# EasyEDA Pro project LY-TB6600-V1.0.eprj

# Board LY_TB6600_V1.0
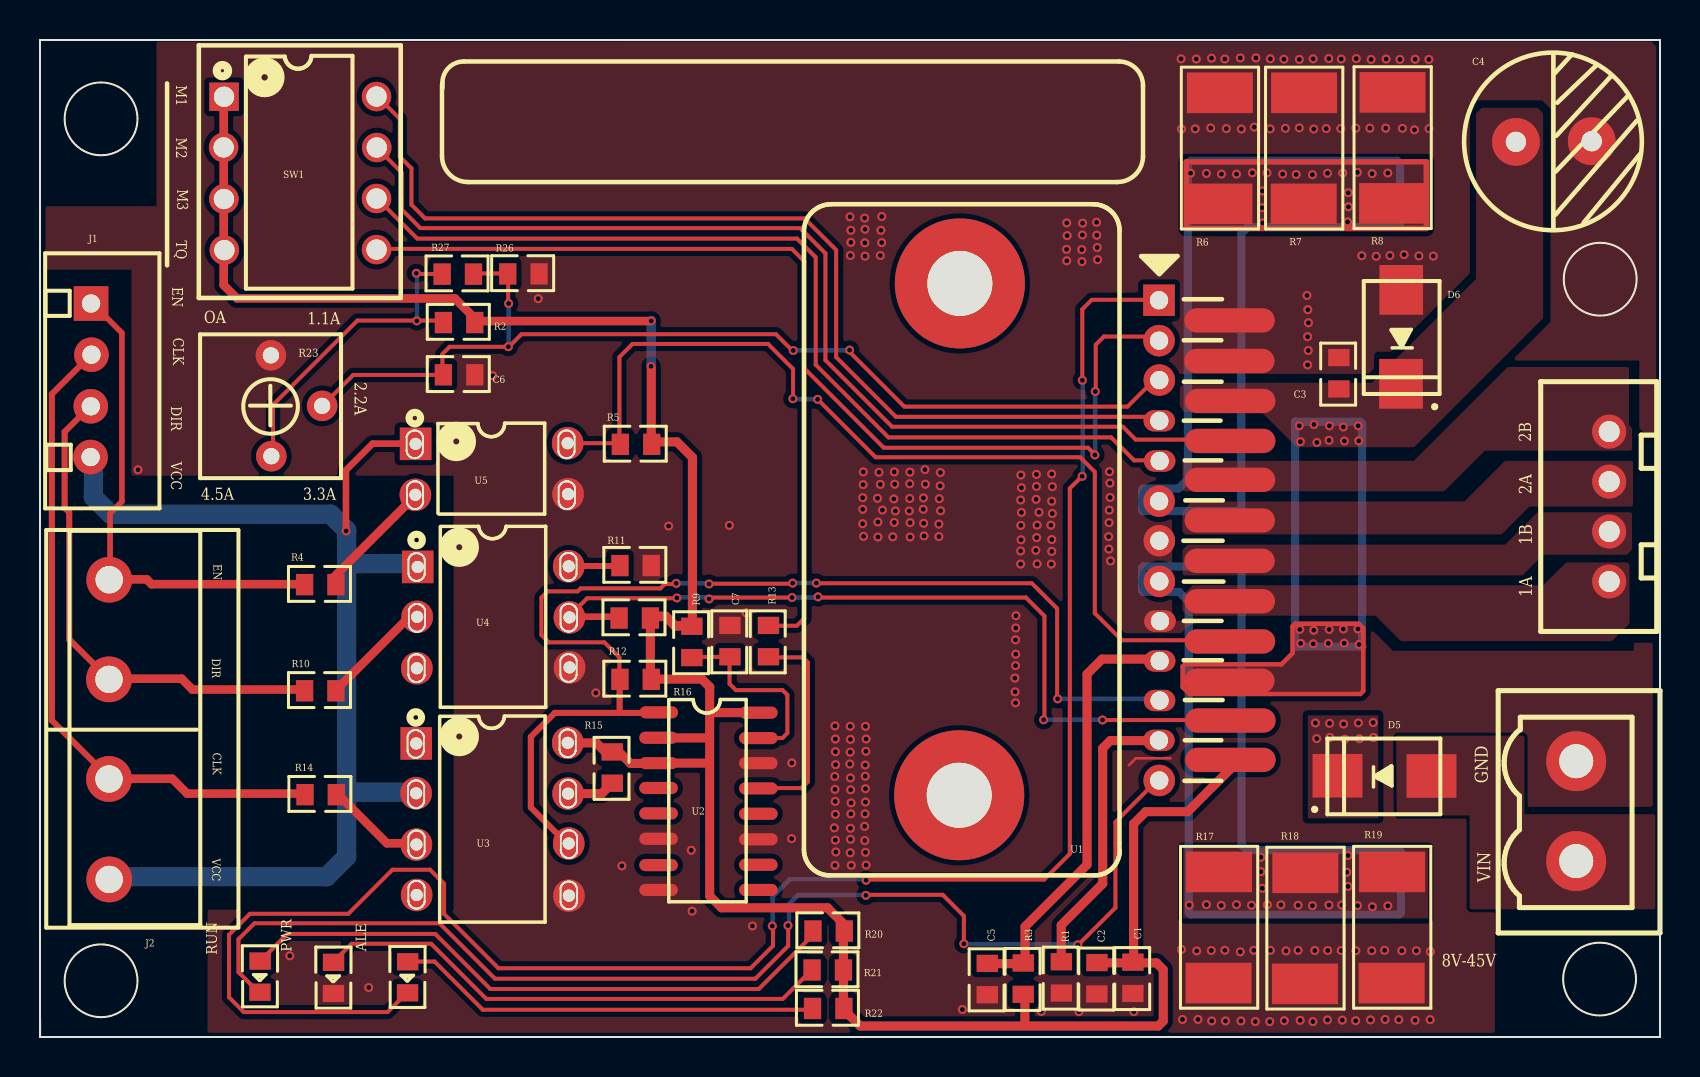
[diagram p0: board, top side]
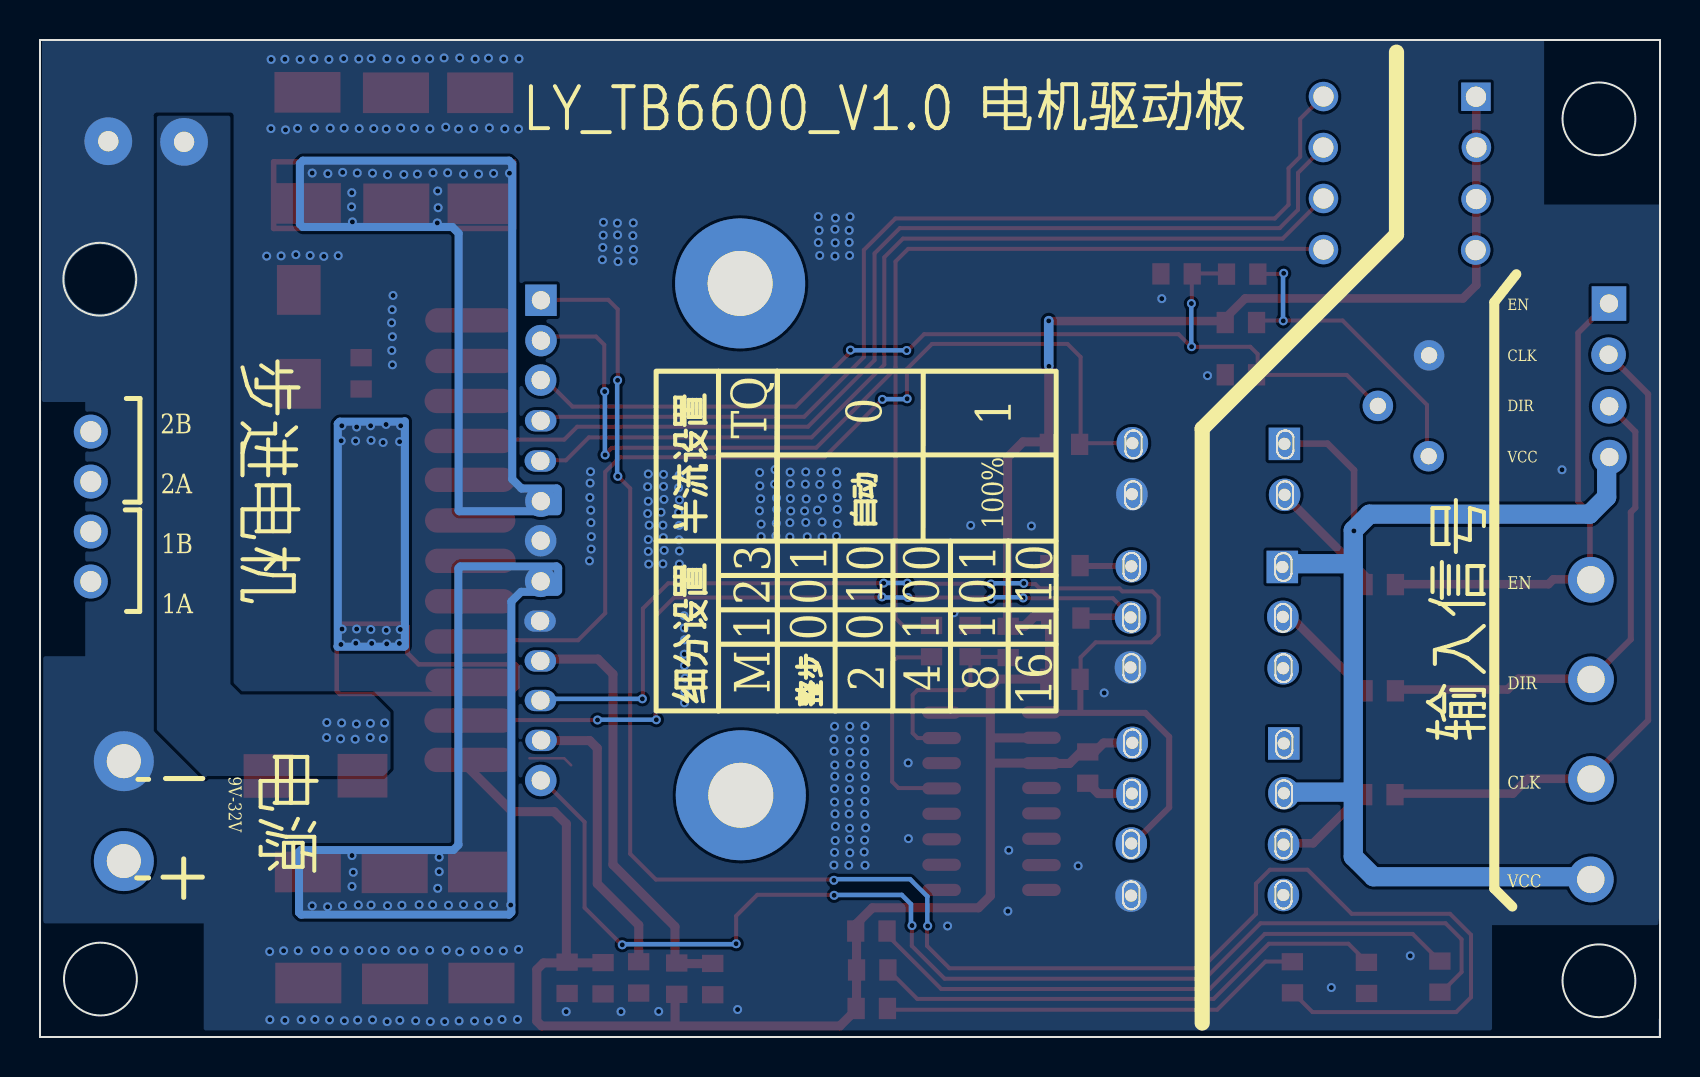
[diagram p1: board, bottom side, seen from below]

Outline 81.01 x 49.89 mm; copper layers: Top Layer, Bottom Layer. Coordinates in mm from the lower left corner of the outline.
Outline path: circle c3.05,45.94 r1.82 ; circle c3.05,2.82 r1.82 ; circle c77.98,2.9 r1.82 ; circle c78.02,37.92 r1.82 ; 0.01,0.91 0.01,0 81.01,0 81.01,49.89 0,49.89 0,0 0.56,0
Stack: Top Layer 0.0356mm / Dielectric1 0.32mm FR-4 er 4.8 / Bottom Layer 0.0356mm

## Design rules (mm)
net U1: Inside Board Components
net C4: Inside Board Components
net SW1: Inside Board Components
net R23: Inside Board Components
net J1: Inside Board Components
net J2: Inside Board Components
net J3: Inside Board Components
net U5: Inside Board Components
net U4: Inside Board Components
net U3: Inside Board Components
net U2: Inside Board Components
net D5: Inside Board Components
net D6: Inside Board Components
net R17: Inside Board Components
net R18: Inside Board Components
net R19: Inside Board Components
net R6: Inside Board Components
net R7: Inside Board Components
net R8: Inside Board Components
net R5: Inside Board Components
net R2: Inside Board Components
net C6: Inside Board Components
net R26: Inside Board Components
net R27: Inside Board Components
net R4: Inside Board Components
net R10: Inside Board Components
net R14: Inside Board Components
net R11: Inside Board Components
net R12: Inside Board Components
net R13: Inside Board Components
net R15: Inside Board Components
net R16: Inside Board Components
net C7: Inside Board Components
net R9: Inside Board Components
net R20: Inside Board Components
net R21: Inside Board Components
net R22: Inside Board Components
net R1: Inside Board Components
net R3: Inside Board Components
net C5: Inside Board Components
net C1: Inside Board Components
net C2: Inside Board Components
net C3: Inside Board Components
net ALE: Inside Board Components
net PWR: Inside Board Components
net RUN: Inside Board Components
template: 用户自定义配置
spacing Clearance (default): track to track 0.201, other pairs 0.201 to 0.201
track width Width (default): min 0.08, default 0.15, max 5
differential pair DiffPairsRouting (default): width min 0.381, default 0.381, max 0.381; gap min 0.254, default 0.254
via RoutingVias (default): diameter min 0.4, default 0.5, max 11; hole min 0.2, default 0.3, max 10

## Placement (name value [footprint] x y rotation side)
ALE  红光  [LED0603]  18.36 3.78 0 top
C1  100NF  [R0603]  54.68 2.16 90 top
C2  1UF  [R0603]  52.88 2.14 90 top
C3  100NF  [R0603]  64.98 32.41 90 top
C4  470UF50V  [C4]  73.83 44.86 0 top
C5  100NF  [R0603]  47.4 2.1 90 top
C6  1UF  [R0603]  20.15 33.11 0 top
C7  1UF  [R0603]  34.53 19.01 90 top
D5  SS54  [SMB]  69.58 13.1 0 top
D6  CR  [SMB]  68.03 37.38 90 top
J1  CON4-2.54MM  [J1]  2.55 36.71 0 top
J2  CON4-5.08MM接线座  [J2]  3.44 22.86 0 top
J3  WJ2EDGVC-5.08-2P  [CONN-TH_WJ2EDGVC-5.08-2P]  76.81 11.3 270 top
J4  HX-XH2.54-4PZZ  [CONN-TH_4P-P2.50-XH2.54-4P]  78.46 26.54 270 top
NOREF  -  [Pad_ie39]  45.96 12.1 180 top
NOREF#2  -  [Pad_ie40]  46 37.71 180 top
PWR  红光  [LED0603]  14.65 3.75 0 top
R1  51K 5%  [R0603]  51.1 2.18 90 top
R2  5.1K 5%  [R0603]  20.15 35.72 0 top
R3  12K 5%  [R0603]  49.2 2.12 90 top
R4  330R 5%  [R0603]  13.21 22.61 0 top
R5  4.7K 5%  [R0603]  29 29.63 0 top
R6  0.62R 1%  [SMD2512]  58.93 47.23 0 top
R7  0.62R 1%  [SMD2512]  63.14 47.23 0 top
R8  0.62R 1%  [SMD2512]  67.57 47.25 0 top
R9  560K 5%  [R0603]  32.62 18.97 90 top
R10  330R 5%  [R0603]  13.21 17.3 0 top
R11  56K 5%  [R0603]  28.98 23.56 0 top
R12  4.7K 5%  [R0603]  28.94 20.94 0 top
R13  5.1K 5%  [R0603]  36.45 19.01 90 top
R14  330R 5%  [R0603]  13.23 12.1 0 top
R15  1K 5%  [R0603]  28.64 12.68 90 top
R16  4.7K 5%  [R0603]  28.98 17.87 0 top
R17  0.62R 1%  [SMD2512]  58.89 8.24 0 top
R18  0.62R 1%  [SMD2512]  63.21 8.2 0 top
R19  0.62R 1%  [SMD2512]  67.55 8.24 0 top
R20  4.7K 5%  [R0603]  38.63 5.27 0 top
R21  4.7K 5%  [R0603]  38.59 3.33 0 top
R22  4.7K 5%  [R0603]  38.61 1.4 0 top
R23  P103(10K)  [R23]  11.65 28.92 0 top
R26  NC  [R0603]  23.37 38.16 0 top
R27  NC  [R0603]  20.09 38.15 0 top
RUN  红光  [LED0603]  10.98 3.81 0 top
SW1  4位拨码开关  [SW1]  9.23 46.99 0 top
U1  TOSHIBA TB6600HG  [U1]  55.96 36.84 0 top
U2  74HC123D  [SOP16]  30.91 16.17 0 top
U3  EL6N137  [U3]  18.82 14.8 0 top
U4  EL4N35  [U4]  18.91 23.58 0 top
U5  CT 521GB  [U5]  18.8 29.64 0 top

## Footprints (pads in the part's own frame, mm; a bottom-side part is the same pattern mirrored in y, then rotated)
C4
  round 2.388 hole 1.016: 1(-0.032,-0.064) 2(3.757,-0.032)
CONN-TH_4P-P2.50-XH2.54-4P
  round 1.7 hole 1.05: 1(3.75,0) 2(1.25,0) 3(-1.25,0) 4(-3.75,0)
CONN-TH_WJ2EDGVC-5.08-2P
  round 3 hole 1.7: 1(-2.499,0) 2(2.499,0)
J1
  rect 1.727x1.727 hole 0.914: 1(-0.004,-0.004)
  round 1.727 hole 0.914: 2(0.018,-2.564) 3(-0.014,-5.147) 4(-0.025,-7.687)
J2
  round 2.286 hole 1.371: 1(0.018,0.018) 2(0.007,-4.967) 3(0.007,-9.951) 4(0.018,-14.979)
LED0603
  rect 1.067x0.864 smd: 1(0.028,-0.014) 2(0.023,-1.569)
Pad_ie39
  round 6.503 hole 3.251: 5(0,0)
Pad_ie40
  round 6.503 hole 3.251: 6(0,0)
R23
  round 1.524 hole 0.813: 1(-0.077,0.145) 2(2.462,2.663) 3(-0.099,5.193)
R0603
  rect 0.864x1.067 smd: 1(0.018,0.029) 2(1.584,0.029)
SMB
  rect 2.489x2.184 smd: 1(0,-0.032) 2(-4.699,-0.021)
SMD2512
  rect 3.302x2.032 smd: 1(0.064,0.021) 2(0.043,-5.535)
SOP16
  oval 1.931x0.61 smd: 1(0.034,0.07) 2(0.023,-1.2) 3(0.023,-2.47) 4(0.023,-3.713) 5(0.023,-4.983) 6(0.023,-6.253) 7(0.023,-7.571) 8(0.023,-8.814) 9(5.013,-8.814) 10(5.013,-7.554) 11(5.013,-6.279) 12(5.013,-5.004) 13(5.013,-3.734) 14(5.013,-2.47) 15(5.013,-1.215) 16(5.013,0.055)
SW1
  rect 1.473x1.423 hole 1.016: 1(-0.03,0.055)
  round 1.473 hole 1.016: 2(-0.051,-2.48) 3(-0.035,-5.062) 4(-0.014,-7.618) 5(7.595,-7.591) 6(7.595,-5.035) 7(7.606,-2.485) 8(7.595,0.066)
U1
  rect 1.575x1.575 hole 0.914: 1(-0.004,0.023)
  oval 4.521x1.219 smd: 2(3.525,-0.985) 4(3.514,-3.017) 6(3.556,-5.016) 8(3.556,-7.017) 10(3.546,-8.964) 12(3.535,-10.996) 14(3.525,-13.018) 16(3.535,-15.039) 18(3.546,-17.05) 20(3.514,-19.018) 22(3.567,-21.008) 24(3.567,-22.977)
  round 1.575 hole 0.914: 3(-0.004,-1.998) 5(0.012,-3.972) 11(0.002,-10.031) 13(0.012,-12.01) 15(0.012,-14.042) 25(0.007,-24.006)
  oval 1.575x1.067 hole 0.914: 7(0.012,-6.01) 9(0.028,-8.02) 17(0.044,-16.032) 19(0.028,-18.027) 21(0.023,-20.006) 23(-0.009,-22.001)
U3
  rect 1.575x1.625 hole 0.61: 1(-0.009,-0.109)
  oval 1.575x1.625 hole 0.61: 2(-0.014,-2.602) 3(0.002,-5.168) 4(0.012,-7.692) 5(7.627,-7.724) 6(7.617,-5.115) 7(7.585,-2.618) 8(7.569,-0.077)
U4
  rect 1.575x1.625 hole 0.61: 1(-0.019,-0.061)
  oval 1.575x1.625 hole 0.61: 2(-0.046,-2.559) 3(-0.062,-5.131) 4(7.574,-5.088) 5(7.569,-2.586) 6(7.532,-0.03)
U5
  rect 1.575x1.625 hole 0.61: 1(-0.019,0.044)
  oval 1.575x1.625 hole 0.61: 2(-0.03,-2.506) 3(7.606,-2.474) 4(7.585,0.076)

## Nets
R20-1: R20.1 RUN.1
R21-1: PWR.1 R21.1
R22-1: ALE.1 R22.1
R23-1: R2.1 R23.1 R27.1
U1-1: ALE.2 U1.1
U1-3: R13.2 SW1.5 U1.3
U1-5: C6.1 R23.2 R26.1 R27.2 U1.5
U1-6: C3.1 C4.1 D5.2 D6.2 U1.6 U1.20
U1-7: SW1.8 U1.7
U1-8: SW1.7 U1.8
U1-9: SW1.6 U1.9
U1-10: J4.4 U1.10
U1-11: R6.2 R7.2 R8.2 U1.11
U1-12: J4.3 U1.12
U1-13: C1.1 C2.1 C3.2 C4.2 C5.1 C6.2 C7.2 D6.1 J3.1 PWR.2 R1.1 R6.1 R7.1 R8.1 R11.2 R17.2 R18.2 R19.2 R23.3 R26.2 U1.2 U1.4 U1.13 U1.17 U2.6 U2.8 U2.11 U2.14 U3.5 U4.4 U5.3
U1-14: J4.2 U1.14
U1-15: R17.1 R18.1 R19.1 U1.15
U1-16: J4.1 U1.16
U1-18: R5.1 U1.18 U5.4
U1-19: C5.2 R3.2 U1.19
U1-21: R16.1 U1.21 U2.1 U3.6
U1-22: R12.1 U1.22 U4.5
U1-23: R1.2 U1.23
U1-24: C1.2 C2.2 R2.2 R3.1 R5.2 R9.2 R12.2 R15.2 R16.2 R20.2 R21.2 R22.2 SW1.1 SW1.2 SW1.3 SW1.4 U1.24 U2.2 U2.3 U2.16 U3.8
U1-25: RUN.2 U1.25
U2-4: U2.4
U2-5: U2.5
U2-7: U2.7
U2-9: U2.9
U2-10: U2.10
U2-12: U2.12
U2-13: R13.1 U2.13
U2-15: C7.1 R9.1 U2.15
U3-1: U3.1
U3-3: R14.2 U3.3
U3-4: U3.4
U3-7: R15.1 U3.7
U4-2: R10.2 U4.2
U4-3: U4.3
U4-6: R11.1 U4.6
U5-2: R4.2 U5.2
UNNAMEDNET1: J1.2 J2.3 R14.1
UNNAMEDNET2: J1.3 J2.2 R10.1
UNNAMEDNET3: J1.4 J2.4 U3.2 U4.1 U5.1
UNNAMEDNET4: J1.1 J2.1 R4.1
UNNAMEDNET5: D5.1 J3.2

Pads without a net: NOREF 5; NOREF#2 6

## Via types
v1: diameter 0.45, hole 0.25, Top Layer to Bottom Layer, 341 vias

## Routing (per net, layer and track width the routed paths; a pad name or vN(x,y) marks a point on that pad's centre or on a via; arc(x,y) is an arc through that point)
R20-1: length 30.1
  Top Layer w0.2: 38.54,5.01 35.94,2.4 22.52,2.4 19.76,5.16 12.37,5.16 11.18,3.97 11.13,3.97
R21-1: length 25.6
  Top Layer w0.2: 38.33,3.1 37.14,1.91 22.32,1.91 19.56,4.67 15.58,4.67 14.76,3.85 14.67,3.85
R22-1: length 20.8
  Top Layer w0.2: 18.66,3.78 19.73,3.78 22.14,1.37 38.48,1.37
R23-1: length 16
  Top Layer w0.2: 11.65,29 11.65,31.63 15.87,35.85 19.85,35.85 ; 18.88,38.18 19.98,38.18
  Bottom Layer w0.226: 18.85,35.88 18.85,38.23
  vias: v1(18.82,38.22) v1(18.84,35.84)
U1-1: length 93.6
  Top Layer w0.2: 18.38,2.16 18.29,2.16 17.38,1.25 10.19,1.25 9.45,1.99 9.45,5.12 10.5,6.17 15.42,6.17 17.62,8.37 19.51,8.37 20.2,7.67 20.2,6.16 22.92,3.44 35.53,3.44 36.65,4.56 36.65,5.47 ; 52.12,32.89 52.12,36.42 52.59,36.89 55.43,36.89 ; 41.37,7.88 50.21,7.88 51.49,9.17 51.49,27.45 52.08,28.04 52.08,28.05
  Bottom Layer w0.226: 52.14,28.19 52.14,32.87 ; 41.28,7.9 37.5,7.9 36.64,7.04 36.64,5.55
  vias: v1(36.62,5.56) v1(41.31,7.84) v1(52.12,32.86) v1(52.11,28.06)
U1-3: length 65.6
  Top Layer w0.2: 17.18,39.44 37.59,39.44 38.23,38.8 38.23,33.45 42.19,29.49 52.41,29.49 52.73,29.17 52.73,29.09 ; 55.55,35.05 53.2,35.05 52.79,34.64 52.79,32.27 ; 38.23,33.53 38.23,20.96 37.85,20.58 36.85,20.58
  Bottom Layer w0.226: 52.76,29.15 52.76,32.31
  vias: v1(52.77,32.3) v1(52.75,29.13)
U1-5: length 50.7
  Top Layer w0.2: 21.86,38.21 23.21,38.21 23.41,38.01 23.41,36.77 ; 40.48,34.28 43.22,31.54 54.38,31.54 55.88,33.05 55.89,33.05 ; 14.38,31.59 14.38,31.85 15.66,33.13 20.18,33.13 20.12,33.19 20.12,34.17 20.48,34.54 23.45,34.54 24.08,35.17 36.8,35.17 37.59,34.37
  Bottom Layer w0.226: 23.44,34.63 23.44,36.71 ; 37.74,34.36 40.46,34.36
  vias: v1(23.43,36.7) v1(23.42,34.54) v1(37.67,34.35) v1(40.48,34.37)
U1-6: length 53.4
  Top Layer w0.226: 57.13,18.53 57.25,18.65 62.07,18.65 62.63,19.21 62.63,20.54 62.77,20.68 65.96,20.68 66.17,20.47 66.17,17.31 66.02,17.17 57.48,17.17 57.14,17.51 57.14,18.56
  Bottom Layer w0.403: 62.76,30.81 62.76,19.57 62.79,19.54 66.13,19.54 66.11,19.55 66.11,30.69 66.01,30.79 62.79,30.79
  vias: v1(62.97,30.59) v1(63.02,29.79) v1(62.99,20.39) v1(63.03,19.7) v1(63.7,30.65) v1(63.69,20.35) v1(63.67,19.67) v1(63.85,29.75) v1(63.78,15.72) v1(63.84,14.93) v1(64.45,29.86) v1(64.46,20.39) v1(64.42,19.7) v1(64.47,30.59) v1(64.48,15.7) v1(64.49,14.99) v1(65.17,30.52) v1(65.23,29.82) v1(65.17,20.42) v1(65.21,19.71) v1(65.18,15.66) v1(65.25,14.9) v1(65.91,30.59) v1(65.95,29.83) v1(65.9,20.42) v1(65.96,19.64) v1(65.92,15.72) v1(65.98,14.92) v1(66.66,15.74) v1(66.67,14.99)
U1-7: length 51.3
  Top Layer w0.2: 16.56,47.24 16.69,47.24 17.99,45.94 17.99,44.05 18.57,43.47 18.57,41.65 19.26,40.96 38.23,40.96 39.81,39.38 39.81,34.02 42.79,31.04 55.86,31.04
U1-8: length 50.8
  Top Layer w0.2: 17.19,44.15 18.1,43.24 18.1,41.39 19.02,40.48 38.01,40.48 39.27,39.21 39.27,33.87 42.6,30.54 54.14,30.54 54.79,29.89 57.85,29.89
U1-9: length 47.4
  Top Layer w0.2: 16.74,42.01 16.81,42.01 18.86,39.95 37.85,39.95 38.79,39.02 38.79,33.64 42.42,30 53.56,30 54.71,28.86 55.55,28.86
U1-11: length 90.6
  Top Layer w0.276: 57.37,40.46 69.32,40.46 69.32,43.79 57.32,43.79 57.32,40.45
  Bottom Layer w0.403: 55.11,26.39 55.11,27.39 55.17,27.45 56.93,27.45 57.39,27.91 57.39,43.69 57.55,43.85 67.86,43.85 68.01,43.7 68.01,40.68 67.86,40.53 60.39,40.53 60.07,40.22 60.07,26.35 60.04,26.31 55.13,26.31
  vias: v1(57.53,43.22) v1(58.33,43.21) v1(59.08,43.18) v1(59.83,43.18) v1(60.62,43.24) v1(61.12,42.33) v1(61.1,41.5) v1(61.14,40.74) v1(61.35,43.24) v1(62.14,43.18) v1(62.81,43.16) v1(63.63,43.15) v1(64.38,43.22) v1(65.14,43.23) v1(65.42,42.25) v1(65.43,41.54) v1(65.38,40.79) v1(65.87,43.26) v1(66.61,43.2) v1(67.39,43.23)
U1-13: length 2.2
  Top Layer w0.126: 54.45,13.6 54.8,13.95 56.53,13.95
  vias: v1(4.9,28.38) v1(12.49,4.06) v1(16.44,2.48) v1(22.63,33.09) v1(24.91,36.95) v1(27.79,17.22) v1(29.09,8.56) v1(31.43,25.57) v1(32.57,9.35) v1(32.61,6.3) v1(34.47,25.6) v1(35.31,21.23) v1(35.62,5.56) v1(37.59,13.72) v1(37.58,9.93) v1(39.75,15.57) v1(39.74,13.04) v1(39.75,12.39) v1(39.76,11.79) v1(39.72,10.47) v1(39.75,8.59) v1(39.77,14.91) v1(39.77,14.28) v1(39.78,13.63) v1(39.77,11.14) v1(39.77,9.85) v1(39.79,9.26) v1(40.5,41.04) v1(40.55,40.37) v1(40.55,39.76) v1(40.52,39.11) v1(40.51,15.55) v1(40.52,14.89) v1(40.51,14.26) v1(40.49,13.66) v1(40.52,12.96) v1(40.53,12.37) v1(40.56,11.72) v1(40.55,11.17) v1(40.52,10.45) v1(40.52,9.9) v1(40.51,9.22) v1(40.57,8.59) v1(41.16,27.64) v1(41.14,26.99) v1(41.14,26.41) v1(41.14,25.69) v1(41.23,40.98) v1(41.25,40.42) v1(41.24,39.74) v1(41.25,39.07) v1(41.17,28.28) v1(41.18,25.05) v1(41.26,13.61) v1(41.26,13.05) v1(41.25,11.17) v1(41.23,10.54) v1(41.24,9.83) v1(41.27,15.55) v1(41.31,14.91) v1(41.3,14.3) v1(41.27,12.43) v1(41.27,11.76) v1(41.27,9.24) v1(41.31,8.6) v1(41.95,28.26) v1(41.88,26.96) v1(41.9,25.77) v1(41.9,25.02) v1(42.05,40.37) v1(42.02,39.11) v1(42.02,27.65) v1(42.09,41.05) v1(42.09,39.75) v1(42.13,26.37) v1(42.64,25.03) v1(42.71,28.28) v1(42.74,27.66) v1(42.69,26.92) v1(42.71,25.75) v1(42.77,26.32) v1(43.47,26.32) v1(43.5,28.27) v1(43.49,27.68) v1(43.49,26.95) v1(43.51,25.74) v1(43.51,25.02) v1(44.16,26.41) v1(44.25,28.39) v1(44.17,26.98) v1(44.19,25.71) v1(44.21,25.07) v1(44.27,27.66) v1(44.95,25.66) v1(44.95,25.04) v1(45.02,28.25) v1(45.01,27.58) v1(44.97,26.93) v1(45.03,26.33) v1(46.12,1.38) v1(48.75,17.96) v1(48.76,17.27) v1(48.8,21.08) v1(48.79,20.47) v1(48.78,19.88) v1(48.79,19.16) v1(48.78,18.58) v1(48.78,16.72) v1(49.04,28.12) v1(49.03,26.87) v1(49.04,25.6) v1(49.05,24.88) v1(49.03,24.32) v1(49.03,23.66) v1(49.08,27.49) v1(49.08,26.25) v1(49.83,28.15) v1(49.83,27.55) v1(49.81,26.9) v1(49.86,25.61) v1(49.84,24.99) v1(49.8,24.35) v1(49.86,23.68) v1(49.95,26.26) v1(50.07,1.28) v1(50.55,25.61) v1(50.57,23.66) v1(50.59,28.17) v1(50.62,27.54) v1(50.59,26.81) v1(50.62,26.19) v1(50.59,24.89) v1(50.59,24.3) v1(51.34,40.74) v1(51.36,40.1) v1(51.33,39.41) v1(51.34,38.84) v1(51.95,1.27) v1(52.13,40.72) v1(52.12,40.13) v1(52.09,39.4) v1(52.1,38.8) v1(52.83,40.77) v1(52.84,40.12) v1(52.86,39.51) v1(52.89,38.89) v1(53.47,26.36) v1(53.46,25.74) v1(53.44,25.04) v1(53.45,24.42) v1(53.48,28.29) v1(53.5,27.72) v1(53.51,27) v1(53.53,23.82) v1(54.7,1.27) v1(57.05,48.95) v1(57.08,45.43) v1(57.08,4.38) v1(57.13,0.88) v1(57.76,45.45) v1(57.82,48.94) v1(57.84,4.31) v1(57.9,0.88) v1(58.54,45.49) v1(58.57,4.33) v1(58.58,48.98) v1(58.59,0.8) v1(59.25,48.94) v1(59.25,4.34) v1(59.32,45.46) v1(59.28,0.8) v1(60.02,48.99) v1(60.02,4.27) v1(60.05,0.8) v1(60.07,45.43) v1(60.72,45.53) v1(60.7,4.34) v1(60.8,48.99) v1(60.77,0.77) v1(61.52,48.95) v1(61.51,45.45) v1(61.52,4.34) v1(61.49,0.77) v1(62.2,48.93) v1(62.22,0.82) v1(62.27,45.47) v1(62.3,4.31) v1(62.91,4.34) v1(62.97,48.92) v1(62.97,45.49) v1(63.01,0.84) v1(63.35,37.11) v1(63.39,36.4) v1(63.43,35.74) v1(63.38,35.04) v1(63.42,34.35) v1(63.38,33.63) v1(63.66,48.95) v1(63.65,0.77) v1(63.69,45.43) v1(63.74,4.33) v1(64.32,45.46) v1(64.44,48.96) v1(64.39,4.33) v1(64.38,0.86) v1(65.07,48.94) v1(65.05,45.46) v1(65.07,4.33) v1(65.12,0.85) v1(65.82,48.96) v1(65.8,45.48) v1(65.8,4.32) v1(65.79,0.82) v1(66.09,39.1) v1(66.56,48.92) v1(66.5,45.48) v1(66.53,0.86) v1(66.59,4.32) v1(66.81,39.06) v1(67.24,4.34) v1(67.26,0.88) v1(67.31,48.94) v1(67.29,45.48) v1(67.5,39.11) v1(67.95,0.87) v1(68,48.92) v1(68.13,45.47) v1(68.09,4.32) v1(68.21,39.15) v1(68.76,48.93) v1(68.73,45.39) v1(68.76,0.84) v1(68.82,4.32) v1(68.95,39.08) v1(69.45,48.92) v1(69.46,45.46) v1(69.52,4.28) v1(69.51,0.87) v1(69.67,39.07)
U1-15: length 59.9
  Bottom Layer w0.403: 55.1,22.33 55.1,23.47 55.17,23.55 59.99,23.55 60.08,23.45 60.08,9.61 60.34,9.35 67.96,9.35 68.05,9.26 68.05,6.23 67.95,6.13 57.55,6.13 57.44,6.24 57.44,21.79 56.95,22.28 55.16,22.28
  vias: v1(57.47,6.6) v1(58.33,6.63) v1(59.07,6.58) v1(59.83,6.63) v1(60.58,6.59) v1(61.05,9) v1(61.05,8.28) v1(61.12,7.44) v1(61.37,6.61) v1(62.05,6.61) v1(62.91,6.59) v1(63.63,6.57) v1(64.45,6.6) v1(65.09,6.6) v1(65.34,8.24) v1(65.41,9.08) v1(65.41,7.54) v1(65.88,6.57) v1(66.62,6.52) v1(67.39,6.56)
U1-18: length 46.6
  Top Layer w0.2: 38.95,31.85 41.78,29.01 52.01,29.01 52.74,28.28 52.74,21.21 54.1,19.85 57.71,19.85 57.75,19.81 57.75,19.9 ; 26.82,29.71 28.96,29.71 28.97,29.73 28.97,34.03 29.63,34.68 36.4,34.68 37.66,33.43 37.66,31.95
  Bottom Layer w0.226: 37.61,31.92 38.82,31.92
  vias: v1(37.65,31.94) v1(38.88,31.91)
U1-19: length 20.9
  Top Layer w0.454: 47.7,3.67 49.05,3.67 49.26,3.87 49.26,5.52 52.36,8.63 52.36,18.16 53.11,18.91 55.71,18.91
U1-21: length 56.2
  Top Layer w0.2: 28.97,17.96 28.97,19 28.22,19.75 25.44,19.75 25.07,20.12 25.07,21.99 25.38,22.3 26.88,22.3 27.03,22.45 31.02,22.45 31.24,22.66 31.73,22.66 ; 33.52,22.68 37.53,22.68 ; 50.86,17 50.86,21.44 49.59,22.71 38.95,22.71
  Top Layer w0.301: 28.98,16.3 28.98,17.54 ; 30.49,16.22 25.74,16.22 24.54,15.02 24.54,11.49 26.04,10 26.04,9.59
  Bottom Layer w0.226: 37.64,22.72 38.82,22.72 ; 50.92,16.92 55.58,16.92 ; 31.86,22.71 33.4,22.71
  vias: v1(31.81,22.7) v1(33.45,22.67) v1(37.63,22.71) v1(38.82,22.71) v1(50.89,16.92)
U1-22: length 39.2
  Top Layer w0.2: 50.22,15.89 50.22,21.07 49.3,21.99 38.93,21.99 ; 31.83,21.96 27.36,21.96 26.62,21.21 26.39,21.21 ; 53.16,15.86 57.99,15.86 ; 33.54,21.99 37.58,21.99
  Top Layer w0.327: 26.76,21.03 28.85,21.03
  Bottom Layer w0.226: 37.64,22 38.88,22 ; 31.86,22.01 33.39,22.01 ; 50.19,15.88 53.01,15.88
  vias: v1(31.85,21.97) v1(33.45,21.92) v1(37.6,21.99) v1(38.9,22.02) v1(50.19,15.88) v1(53.13,15.86)
U1-23: length 14.4
  Top Layer w0.454: 55.9,14.83 53.52,14.83 53.14,14.45 53.14,7.67 51.07,5.6 51.07,3.84
U1-24: length 124.2
  Top Layer w0.428: 9.19,46.78 9.19,37.62 9.85,36.96 20.74,36.96 21.88,35.82 30.48,35.82
  Top Layer w0.454: 30.52,20.89 30.52,18 30.62,17.91 33.09,17.91 33.49,17.52 33.49,7.06 34.08,6.47 39.38,6.47 40.17,5.67 40.17,1.39 41.01,0.55 55.92,0.55 56.17,0.8 56.17,3.37 55.83,3.71 53.01,3.71 ; 31.31,13.71 33.34,13.71 ; 33.57,16.24 35.38,16.24 ; 49.25,0.63 49.25,1.78 ; 54.68,3.88 54.68,10.67 55.29,11.28 57.39,11.28 59.76,13.65 ; 30.57,33.49 30.57,29.79 30.55,29.78 31.85,29.78 32.62,29 32.62,20.74 ; 26.73,14.72 27.82,14.72 28.25,14.28 28.94,14.28 29.53,13.69 30.19,13.69 ; 31.48,14.97 33.43,14.97
  Top Layer w0.479: 32.44,20.57 31.76,20.57 31.28,21.05 30.68,21.05 30.52,20.89
  Bottom Layer w0.479: 30.57,33.62 30.57,35.84
  vias: v1(30.57,35.84) v1(30.55,33.56)
U1-25: length 60.8
  Top Layer w0.2: 46.2,4.56 46.2,6.06 45.14,7.12 41.3,7.12 ; 11.02,2.15 9.92,3.25 9.92,4.89 10.73,5.69 19.97,5.69 22.75,2.92 35.77,2.92 37.41,4.56 37.41,5.61 ; 55.52,12.5 53.77,10.76 53.77,6.47 51.95,4.65 51.95,4.65
  Bottom Layer w0.226: 37.45,5.58 37.45,6.65 37.92,7.11 41.25,7.11 ; 46.18,4.64 51.86,4.64
  vias: v1(37.4,5.58) v1(41.3,7.09) v1(46.2,4.67) v1(51.89,4.61)
U2-13: length 9.9
  Top Layer w0.2: 36.43,12.46 38.08,12.46 38.4,12.77 38.4,18.74 38.14,19 36.67,19
U2-15: length 9.2
  Top Layer w0.2: 36.29,14.96 37.12,14.96 37.37,15.21 37.37,17.12 37.13,17.36 34.8,17.36 34.48,17.67 34.48,18.92 34.39,19.02 32.79,19.02
U3-3: length 4.8
  Top Layer w0.428: 18.68,9.69 17.35,9.69 14.99,12.05 14.86,12.05
U3-7: length 1.9
  Top Layer w0.454: 26.69,12.18 28.09,12.18 28.45,12.55
U4-2: length 5.2
  Top Layer w0.428: 18.58,21.15 14.91,17.47 14.89,17.47
U4-6: length 1.9
  Top Layer w0.301: 26.8,23.57 28.74,23.57
U5-2: length 5.6
  Top Layer w0.428: 14.63,22.81 14.63,22.94 18.5,26.82
UNNAMEDNET1: length 32.7
  Top Layer w0.301: 3.41,13.03 0.59,15.84 0.59,32.17 2.52,34.1 2.69,34.1
  Top Layer w0.428: 3.97,12.92 6.62,12.92 7.36,12.18 13.11,12.18
UNNAMEDNET2: length 24.4
  Top Layer w0.276: 2.33,31.38 2.33,31.51
  Top Layer w0.301: 3.48,17.88 1.46,19.9 1.46,26.26 1.23,26.49 1.23,30.28 2.33,31.38
  Top Layer w0.428: 4.05,17.93 7.08,17.93 7.62,17.39 13.18,17.39
UNNAMEDNET3: length 56.2
  Top Layer w0.327: 18.54,29.69 16.63,29.69 15.3,28.36 15.3,25.38
  Bottom Layer w0.962: 2.67,28.79 2.67,27.02 3.53,26.16 14.53,26.16 15.34,25.36 15.34,9.03 14.33,8.02 3.76,8.02 ; 15.6,12.25 18.71,12.25 ; 15.65,23.68 18.43,23.68
  Bottom Layer w0.988: 3.7,8.07 3.76,8.02
  vias: v1(15.31,25.32)
UNNAMEDNET4: length 23.1
  Top Layer w0.2: 2.76,36.34 2.98,36.34
  Top Layer w0.276: 2.98,36.34 4.1,35.23 4.1,26.8 3.5,26.2 3.5,23.58
  Top Layer w0.428: 3.92,22.9 5.33,22.9 5.58,22.66 13.2,22.66

## Copper pours and planes (outline as drawn; the poured copper is in the pictures)
U1-6 on Top Layer: 57.27,31.36 61.14,31.36 62.89,29.61 68.67,29.61 75.06,36 75.06,46.18 74.83,46.4 72.14,46.4 71.9,46.16 71.9,37.89 66.65,32.64 57.28,32.64 57.1,32.46 57.1,31.61
U1-6 on Top Layer: 63.39,16.1 66.92,16.1 66.92,10.94 63.39,10.94
U1-6 on Top Layer: 57.52,17.31 66.08,17.31 66.08,20.52 62.74,20.52 62.74,19.17 62.18,18.61 57.31,18.61 57.26,18.55 57.26,17.58
U1-6 on Bottom Layer: 71.48,46.1 71.48,17.65 70.97,17.15 64.37,17.15 63.48,16.26 63.48,13.42 63.84,13.06 72.64,13.06 72.75,12.95 75.16,15.37 75.16,45.97 75.17,46.1
U1-6 on Bottom Layer: 62.78,19.65 66.1,19.65 66.1,30.87 62.8,30.87
U1-10 on Top Layer: 57.13,27.31 70.21,27.31 72.24,29.34 79.61,29.34 79.61,33.53 73.39,33.53 68.69,28.83 57.13,28.83
U1-11 on Top Layer: 57.21,43.79 69.43,43.79 69.43,40.45 57.21,40.45
U1-11 on Bottom Layer: 55.29,26.36 59.96,26.36 59.96,40.59 67.87,40.59 67.87,43.71 57.58,43.71 57.58,27.95 56.97,27.34 55.24,27.34
U1-12 on Top Layer: 57.48,26.66 57.13,26.31 57.13,25.27 57.26,25.15 73.08,25.15 74.48,26.54 79.66,26.54 79.66,28.83 73.26,28.83 71.23,26.8 57.48,26.8
U1-13 on Top Layer: 8.38,0.57 40.22,0.57 40.22,0.3 8.38,0.3
U1-13 on Top Layer: 8.38,6.37 8.38,0.21 72.75,0.21 72.75,11.51 80.64,11.51 80.64,19.73 79.69,19.73 79.69,19.33 67.65,19.33 66.23,20.74 62.4,20.74 62.32,20.83 56.78,20.83 56.61,21 56.61,32.89 56.9,33.18 66.43,33.18 66.72,33.46 66.72,34.16 66.84,34.29 67.56,34.29 71.5,38.23 71.5,46.47 71.89,46.86 75.11,46.86 75.53,46.44 75.53,35.79 73.59,33.85 79.97,33.85 79.97,30.47 80.32,30.13 80.75,30.13 80.81,30.19 80.81,49.57 80.57,49.82 5.82,49.81 5.82,41.57 0.28,41.57 0.28,38.4 4.57,38.4 4.57,28.09 20.68,28.09 20.68,6.37
U1-13 on Bottom Layer: 0.18,5.7 8.5,5.7 8.5,0.43 72.72,0.43 72.72,5.79 80.74,5.79 80.74,18.95 78.65,18.95 78.65,31.88 80.82,31.88 80.8,49.84 5.9,49.84 5.9,41.56 0.08,41.56 0.08,6.82
U1-14 on Top Layer: 57.38,24.64 57.13,24.38 57.13,23.1 74.13,23.1 75.16,24.13 79.35,24.13 79.61,24.38 79.61,26.26 74.88,26.26 73.26,24.64
U1-15 on Top Layer: 57.16,9.47 69.42,9.47 69.42,5.94 57.16,5.94
U1-15 on Bottom Layer: 55.31,22.3 57.03,22.3 57.41,21.93 57.41,6.33 57.57,6.16 67.84,6.16 67.96,6.28 67.97,9.23 67.85,9.34 60.28,9.34 59.97,9.66 59.97,23.49 59.96,23.48 55.11,23.48
U1-16 on Top Layer: 57.64,22.61 57.26,22.23 57.13,22.23 57.13,21.34 57.38,21.08 66.78,21.08 68.05,19.81 78.59,19.81 79.48,20.7 79.48,23.62 79.35,23.75 76.31,23.75 75.16,22.61
UNNAMEDNET5 on Top Layer: 67.95,11.19 71.59,11.19 71.59,6.5 80.67,6.5 80.67,11.05 74.13,11.05 74.13,14.98 67.91,14.98

Small or netless copper shapes (teardrops, artwork), in the pictures only: 5 on Top Layer

## Text on the board
Bottom Silkscreen Layer: EN | CLK | DIR | VCC | 9V-32V | 1A | 1B | 2A | 2B | 100% | 自动 | 整步 | 半流设置 | 细分设置 | 0 | 1 | 16 | 8 | 4 | 2 | 3 | M | TQ | LY_TB6600_V1.0 电机驱动板 | 电源 | 步进电机 | 输入信号
Mechanical Layer: T=1.6MM
Top Silkscreen Layer: DIR | VCC | CLK | EN | M1 | M2 | TQ | M3 | 4.5A | OA | 3.3A | 1.1A | 2B | 2.2A | 8V-45V | 2A | GND | VIN | 1B | 1A
